# Altium schematic sheet Partical_Sensor.SchDoc
size A4; SheetNumber: 4; SheetTotal: 9
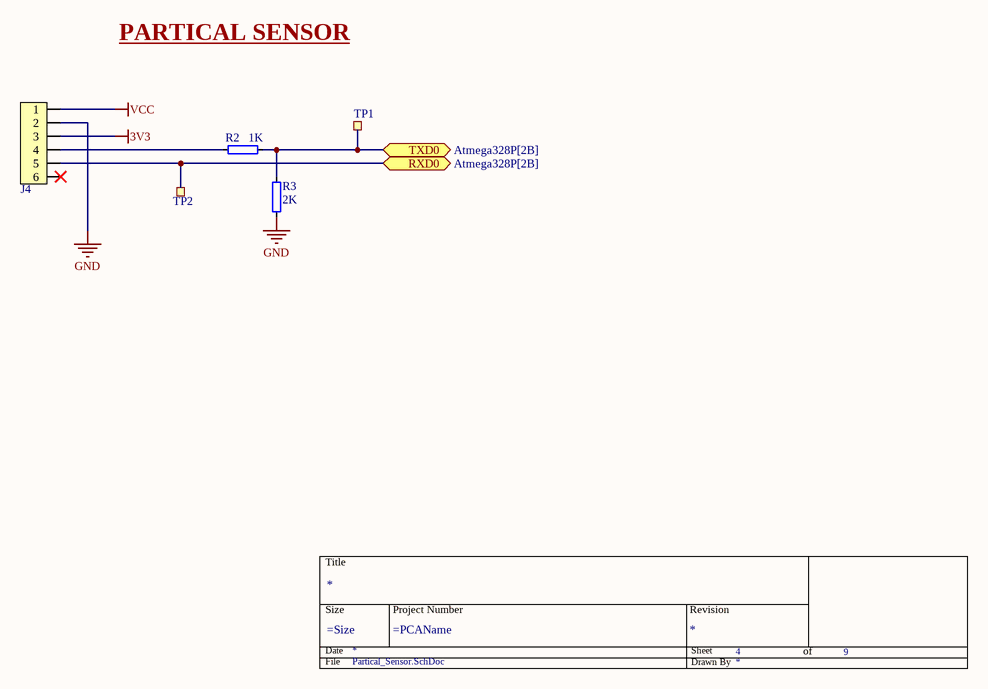
[diagram p0: Partical_Sensor.SchDoc]

## Parts
*  Title Block  (value not drawn)  (graphical)
J4  6way Connector  [TE_640455-6]  (value not drawn)
R2  1K  [RESC2012X65N]
R3  2K  [RESC2012X65N]
TP1  TP  [TESTPAD-TH]  (value not drawn)  (no BOM)
TP2  TP  [TESTPAD-TH]  (value not drawn)  (no BOM)

## Ports
RXD0 (bidir, see Atmega328P[2B]), TXD0 (bidir, see Atmega328P[2B])

## Nets
3V3: J4.3
GND: J4.2 R3.1
VCC: J4.1
RXD0: J4.5 TP2.1 ; port RXD0
TXD0: R2.1 R3.2 TP1.1 ; port TXD0
NetJ4_4: J4.4 R2.2

Not connected (* = marked no-connect by the designer): J4 6*

## Notes on the sheet
- PARTICAL SENSOR
- (in symbol Title Block) Title; Size; Project Number; Revision; Date; Sheet; of; File; Drawn By

## Library data of the parts
J4 = JST 6Way Connector RA: 6Way Right Angle JST-XH connector Male 2.54mm Pitch; Part Number: JST-XH; Manufacturer Part Number: JST-XH; Pin Count: 6; Publisher: Metal Circuits; Value: 6way Connector
R2 R3 = RES_0805: RES SMD 1% 1/10W 0805; Part Number: RES_0805; Pin Count: 2; Publisher: Metal Circuits; FootPrint Doc: 0805
  R2: Value: 1K
  R3: Value: 2K
TP1 TP2 = TESTPAD_TH: Testpoint, through hole; Part Number: Testpoint TH; Artikkelnr Noca: N.A.; Manufacturer: *; Manufacturer Part Number: *; Datasheet: *; Footprint Doc: TESTPAD-TH; LatestRevisionDate: 2009-12-12; Pin Count: 1; Publisher: Nordic Semiconductor; Published: 2009-12-12; Value: TP; Note: *; Supplier: *; Supplier part number: *; 2nd source Supplier: *; 2nd source part number: *; Artikkelnr Simpro: N.A.